# EAGLE design Sensor tile2 (EAGLE 6.6.0)
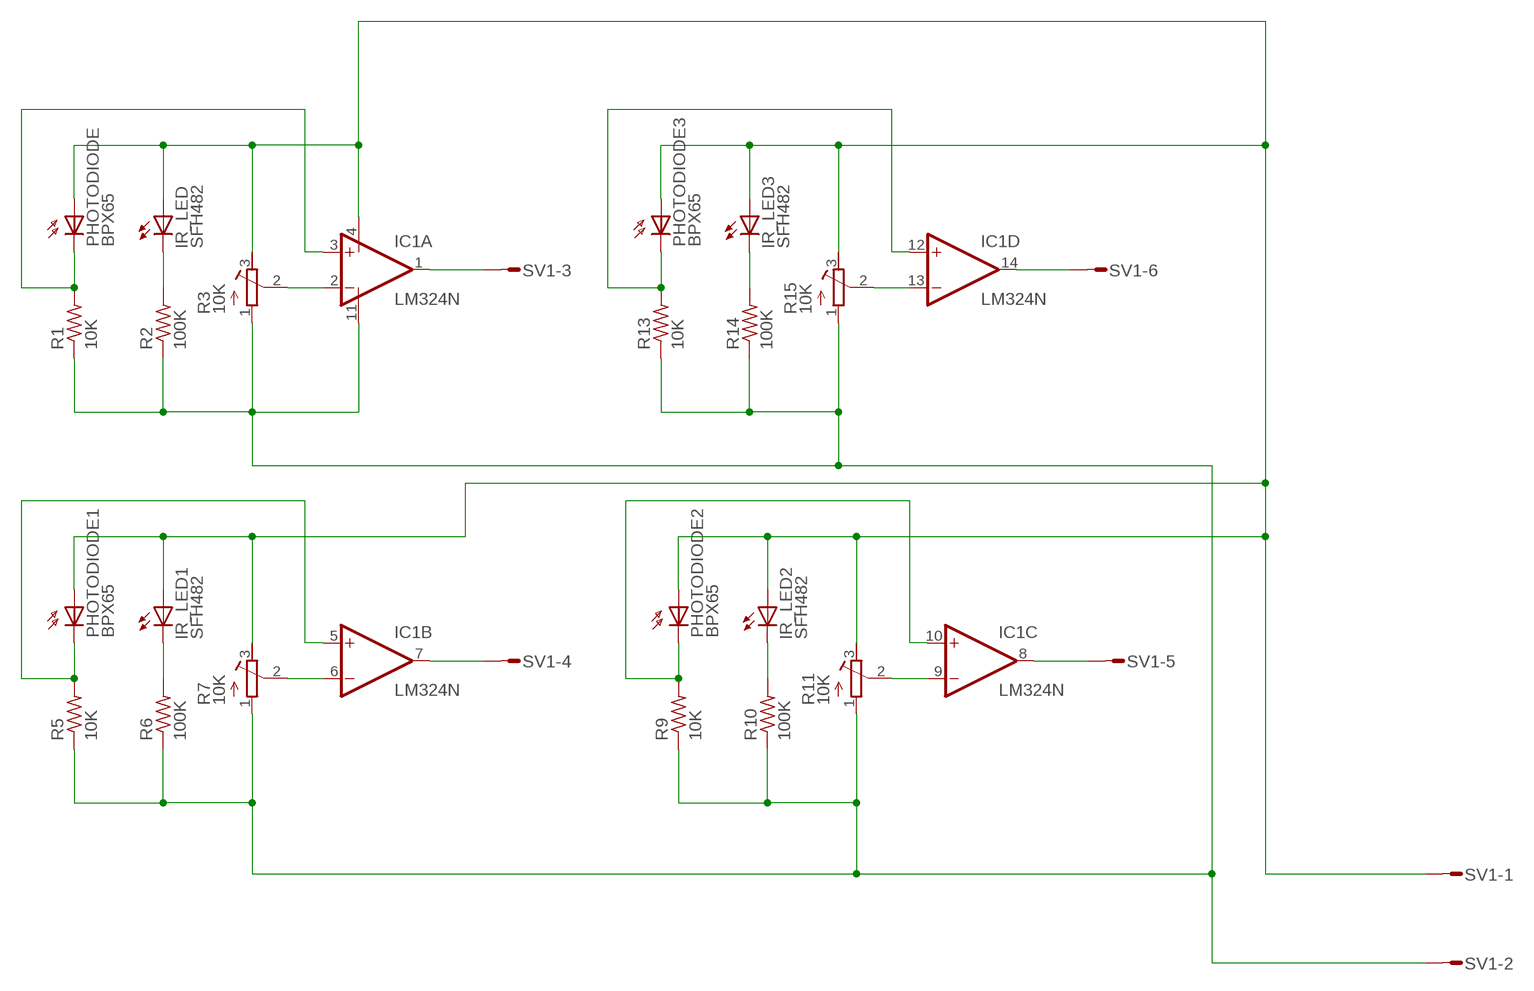
[diagram p0: schematic, sheet 1]

## Parts
IC1  LM324N  [DIL14]
IR_LED  SFH482  [SFH482]
IR_LED1  SFH482  [SFH482]
IR_LED2  SFH482  [SFH482]
IR_LED3  SFH482  [SFH482]
PHOTODIODE  BPX65  [BPX65]
PHOTODIODE1  BPX65  [BPX65]
PHOTODIODE2  BPX65  [BPX65]
PHOTODIODE3  BPX65  [BPX65]
R1  10K  R-US_0204/7  [0204/7]
R2  100K  R-US_0204/7  [0204/7]
R3  10K  R-TRIMM4G/J  [RTRIM4G/J]
R5  10K  R-US_0204/7  [0204/7]
R6  100K  R-US_0204/7  [0204/7]
R7  10K  R-TRIMM4G/J  [RTRIM4G/J]
R9  10K  R-US_0204/7  [0204/7]
R10  100K  R-US_0204/7  [0204/7]
R11  10K  R-TRIMM4G/J  [RTRIM4G/J]
R13  10K  R-US_0204/7  [0204/7]
R14  100K  R-US_0204/7  [0204/7]
R15  10K  R-TRIMM4G/J  [RTRIM4G/J]
SV1  L06P  [L06P]

## Nets
N$2: IC1.3(A:+IN) PHOTODIODE.K(C) R1.2
N$3: IR_LED.K(C) R2.2
N$5: IC1.2(A:-IN) R3.2(S)
N$6: IC1.1(A:OUT) SV1.3
N$8: IC1.4(P:V+) IR_LED1.A IR_LED2.A IR_LED3.A IR_LED.A PHOTODIODE1.A PHOTODIODE2.A PHOTODIODE3.A PHOTODIODE.A R3.3(E) R7.3(E) R11.3(E) R15.3(E) SV1.1
N$9: IC1.5(B:+IN) PHOTODIODE1.K(C) R5.2
N$10: IR_LED1.K(C) R6.2
N$11: IC1.11(P:V-) R1.1 R2.1 R3.1(A) R5.1 R6.1 R7.1(A) R9.1 R10.1 R11.1(A) R13.1 R14.1 R15.1(A) SV1.2
N$12: IC1.6(B:-IN) R7.2(S)
N$14: IC1.7(B:OUT) SV1.4
N$16: IC1.10(C:+IN) PHOTODIODE2.K(C) R9.2
N$17: IR_LED2.K(C) R10.2
N$19: IC1.9(C:-IN) R11.2(S)
N$21: IC1.8(C:OUT) SV1.5
N$23: IC1.12(D:+IN) PHOTODIODE3.K(C) R13.2
N$24: IR_LED3.K(C) R14.2
N$26: IC1.13(D:-IN) R15.2(S)
N$28: IC1.14(D:OUT) SV1.6

## Library data of the parts
IC1 = linear:LM324: OP AMP
IR_LED IR_LED1-IR_LED3 = led:SFH482: IR LED infrared emitting diode, Infineon
PHOTODIODE PHOTODIODE1-PHOTODIODE3 = opto-trans-siemens:BPX65: PHOTO DIODE; MPN: BPX65.; OC_FARNELL: 327451; OC_NEWARK: 06WX2764
R1 R2 R5 R6 R9 R10 R13 R14 = rcl:R-US_: RESISTOR, American symbol
R3 R7 R11 R15 = rcl:R-TRIMM: Trimm resistor
SV1 = con-amp-mt:L06P: AMP MT CONNECTOR; OC_FARNELL: unknown; OC_NEWARK: unknown

## Board
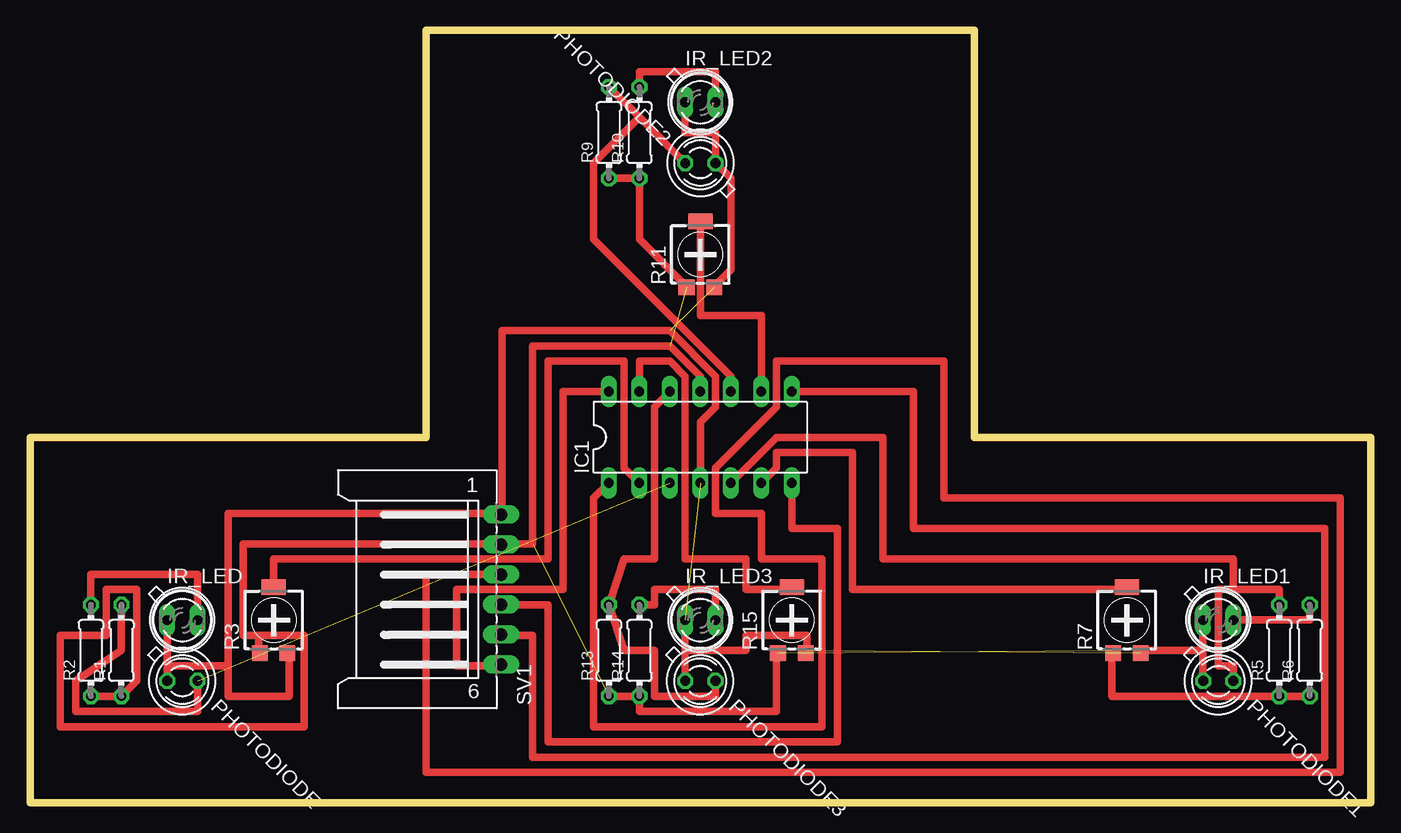
[diagram p1: board, top side]

Size 111.76 x 64.44 mm. Coordinates in mm from the lower left corner, seen from the top.
Outline: 0,0 111.76,0 111.76,30.48 78.74,30.48 78.74,64.44 33.02,64.44 33.02,30.48 0,30.48 0,0
Copper layers (1*16): Top 0.035mm / dielectric 1.5mm / Bottom 0.035mm
Design rules "default": minimum track width 10mil, minimum drill 24mil, track to track 8mil, track to pad 8mil, pad to pad 8mil, via to via 8mil, smd to smd 8mil, copper to edge 40mil, drill to drill 8mil, minimum pad ring 10mil, minimum via ring 8mil, stop-mask expansion 4mil, vias tented up to drill 0mil, thermal gap 10mil

### Footprints (pad centres in the part's own frame; a part is rotated, then mirrored left to right if it is on the bottom)
DIL14 = drill 0.813 long: 1 -7.62,-3.81; 2 -5.08,-3.81; 3 -2.54,-3.81; 4 0,-3.81; 5 2.54,-3.81; 6 5.08,-3.81; 7 7.62,-3.81; 8 7.62,3.81; 9 5.08,3.81; 10 2.54,3.81; 11 0,3.81; 12 -2.54,3.81; 13 -5.08,3.81; 14 -7.62,3.81
SFH482 = drill 0.813 long: A -1.27,0; K 1.27,0
BPX65 = drill 0.813 octagon: A -0.889,-0.889; K 0.889,0.889
0204/7 = drill 0.813 octagon: 1 -3.81,0; 2 3.81,0
RTRIM4G/J = smd 1.3 x 1.3: 1 -1.15,-2.75; 3 1.15,-2.75 | smd 2 x 1.3: 2 0,2.75
L06P = drill 1.016 long: 1 6.25,-6.25; 2 3.75,-6.25; 3 1.25,-6.25; 4 -1.25,-6.25; 5 -3.75,-6.25; 6 -6.25,-6.25

### Placement (x,y rotation side)
IC1  55.88,30.48 0 top
IR_LED  12.7,15.24 0 top
IR_LED1  99.06,15.24 0 top
IR_LED2  55.88,58.42 0 top
IR_LED3  55.88,15.24 0 top
PHOTODIODE  12.7,10.16 315 top
PHOTODIODE1  99.06,10.16 315 top
PHOTODIODE2  55.88,53.34 135 top
PHOTODIODE3  55.88,10.16 315 top
R1  7.62,12.7 90 top
R2  5.08,12.7 90 top
R3  20.32,15.24 0 top
R5  104.14,12.7 90 top
R6  106.68,12.7 90 top
R7  91.44,15.24 0 top
R9  48.26,55.88 90 top
R10  50.8,55.88 90 top
R11  55.88,45.72 0 top
R13  48.26,12.7 90 top
R14  50.8,12.7 90 top
R15  63.5,15.24 0 top
SV1  33.02,17.78 90 top

### Tracks (layer width: path | path; a pad name or v marks a point on that pad's centre or on a via)
N$2  (1 unrouted)
  Top 0.61: R1.2 7.62,13.97 7.62,12.7 3.81,10.16 3.81,7.62 11.43,7.62 13.97,7.62 PHOTODIODE.K
N$3
  Top 0.61: IR_LED.K 13.97,17.78 13.97,19.05 10.16,19.05 5.08,19.05 R2.2
N$5
  Top 0.61: IC1.2 49.53,27.94 49.53,36.83 43.18,36.83 43.18,20.32 20.32,20.32 R3.2 20.32,17.78
N$6
  Top 0.61: IC1.1 46.99,25.4 46.99,6.35 66.04,6.35 66.04,17.78 66.04,20.32 60.96,20.32 60.96,21.59 60.96,24.13 59.69,24.13 57.15,24.13 57.15,27.94 62.23,33.02 62.23,36.83 76.2,36.83 76.2,25.4 109.22,25.4 109.22,2.54 35.56,2.54 33.02,2.54 33.02,13.97 33.02,19.05 38.1,19.05 SV1.3
N$8  (3 unrouted)
  Top 0.61: 97.79,12.7 92.71,12.7 R7.3 | IR_LED1.A 97.79,12.7 | 97.79,12.7 PHOTODIODE1.A | PHOTODIODE2.A 58.42,52.07 58.42,44.45 57.15,43.18 R11.3 | IR_LED2.A 54.61,55.88 57.15,55.88 PHOTODIODE2.A | PHOTODIODE2.A | 54.61,12.7 PHOTODIODE3.A | 54.61,12.7 59.69,12.7 59.69,13.97 63.5,13.97 64.77,13.97 64.77,12.7 R15.3 | 54.61,12.7 IR_LED3.A | 11.43,11.43 16.51,11.43 | 16.51,11.43 16.51,8.89 21.59,8.89 21.59,12.7 R3.3 | 11.43,11.43 PHOTODIODE.A | 11.43,11.43 IR_LED.A | IC1.4 55.88,31.75 57.15,33.02 57.15,35.56 53.34,39.37 39.37,39.37 39.37,24.13 SV1.1 38.1,24.13 16.51,24.13 16.51,11.43
N$9
  Top 0.61: 100.33,17.78 99.06,17.78 99.06,16.51 99.06,11.43 100.33,11.43 PHOTODIODE1.K | 100.33,17.78 104.14,17.78 R5.2 | IC1.5 62.23,30.48 68.58,30.48 71.12,30.48 71.12,20.32 100.33,20.32 100.33,17.78
N$10
  Top 0.61: IR_LED1.K 106.68,15.24 R6.2
N$11  (3 unrouted)
  Top 0.61: 90.17,8.89 93.98,8.89 R5.1 R6.1 | 90.17,8.89 90.17,10.16 | 90.17,10.16 90.17,8.89 | 90.17,8.89 90.17,10.16 | 90.17,10.16 90.17,12.7 R7.1 | R11.1 54.61,43.18 50.8,46.99 R10.1 R9.1 | R15.1 62.23,12.7 62.23,8.89 62.23,7.62 57.15,7.62 50.8,7.62 R14.1 R13.1 | R2.1 R1.1 8.89,10.16 8.89,17.78 6.35,17.78 6.35,13.97 2.54,13.97 2.54,6.35 22.86,6.35 22.86,13.97 19.05,13.97 | 19.05,13.97 17.78,13.97 17.78,21.59 38.1,21.59 SV1.2 39.37,21.59 41.91,21.59 41.91,38.1 53.34,38.1 55.88,35.56 IC1.11 | 19.05,13.97 19.05,12.7 R3.1
N$12
  Top 0.61: IC1.6 62.23,27.94 62.23,29.21 63.5,29.21 68.58,29.21 68.58,27.94 68.58,24.13 68.58,17.78 91.44,17.78 R7.2
N$14
  Top 0.61: IC1.7 63.5,25.4 63.5,22.86 67.31,22.86 67.31,10.16 67.31,5.08 62.23,5.08 43.18,5.08 43.18,12.7 43.18,16.51 39.37,16.51 SV1.4
N$16
  Top 0.61: 50.8,57.15 PHOTODIODE2.K | 50.8,57.15 R9.2 | IC1.10 58.42,35.56 46.99,46.99 46.99,53.34 50.8,57.15
N$17
  Top 0.61: R10.2 50.8,60.96 57.15,60.96 IR_LED2.K
N$19
  Top 0.61: R11.2 55.88,40.64 60.96,40.64 IC1.9
N$21
  Top 0.61: IC1.8 73.66,34.29 73.66,22.86 107.95,22.86 107.95,3.81 41.91,3.81 41.91,11.43 41.91,13.97 39.37,13.97 SV1.5
N$23
  Top 0.61: IC1.12 52.07,33.02 52.07,20.32 50.8,20.32 49.53,20.32 R13.2 49.53,12.7 52.07,12.7 52.07,8.89 55.88,8.89 57.15,8.89 PHOTODIODE3.K
N$24
  Top 0.61: IR_LED3.K 57.15,17.78 52.07,17.78 52.07,16.51 R14.2
N$26
  Top 0.61: IC1.13 50.8,36.83 53.34,36.83 54.61,35.56 54.61,20.32 59.69,20.32 59.69,17.78 63.5,17.78 R15.2
N$28
  Top 0.61: IC1.14 44.45,34.29 44.45,21.59 44.45,17.78 40.64,17.78 35.56,17.78 35.56,11.43 38.1,11.43 SV1.6